# EAGLE schematic arcaduinome (EAGLE 7.1.0)
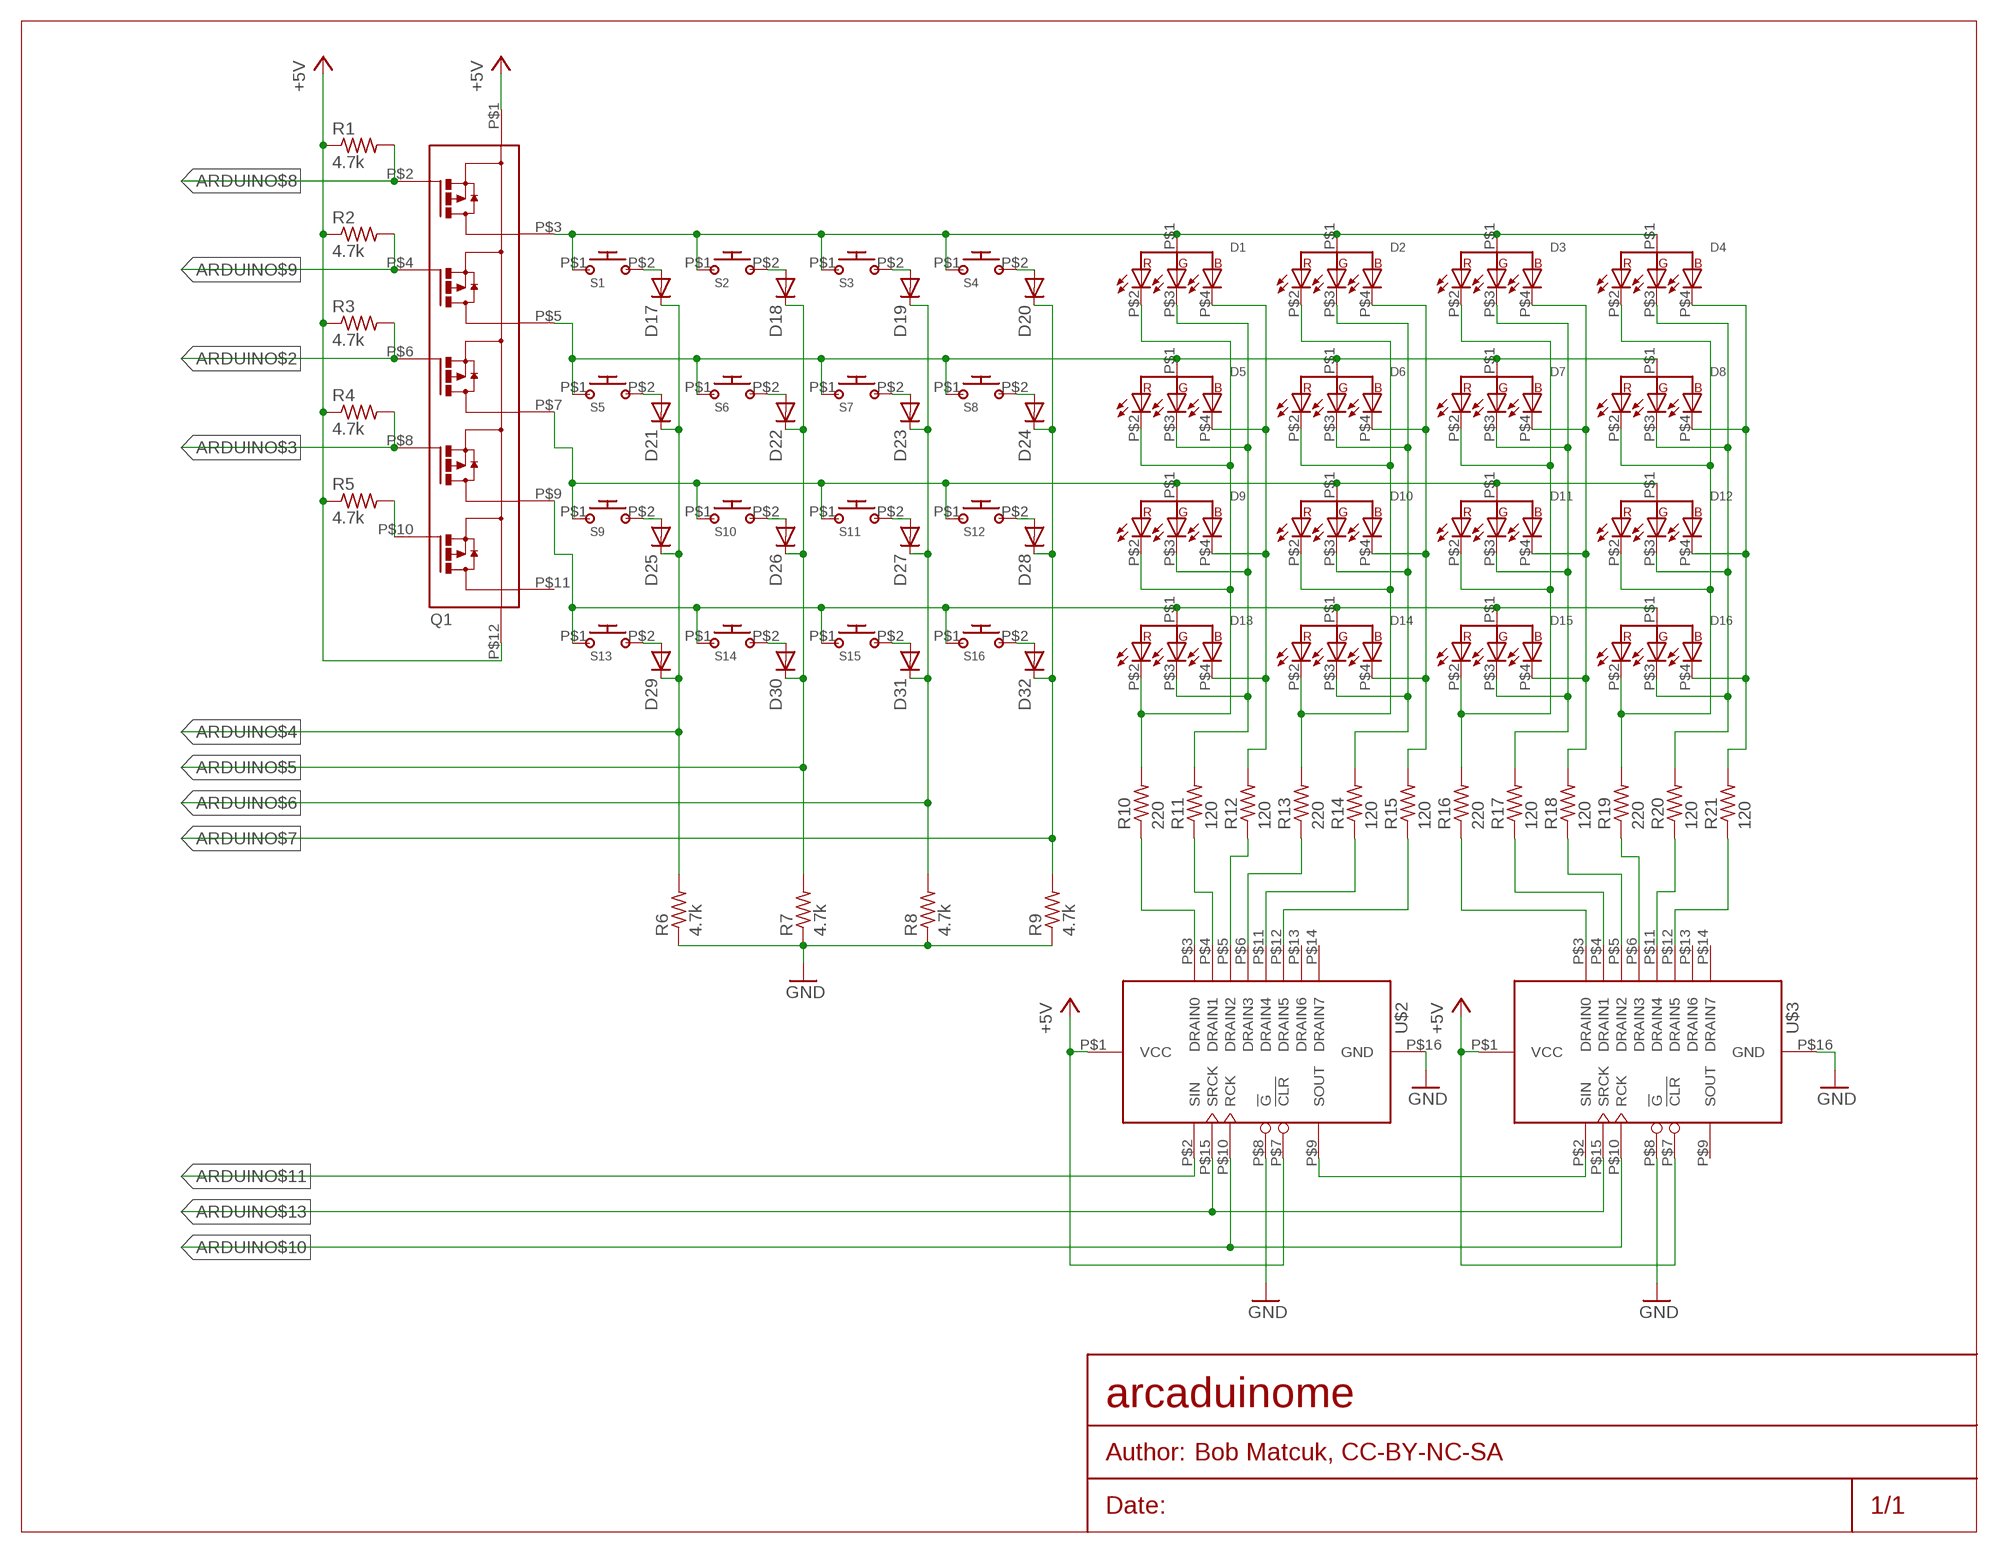
[diagram p0: schematic, sheet 1]

## Parts
D1  FD-5WSRGB-A  [5MM_RGB_LED]
D2  FD-5WSRGB-A  [5MM_RGB_LED]
D3  FD-5WSRGB-A  [5MM_RGB_LED]
D4  FD-5WSRGB-A  [5MM_RGB_LED]
D5  FD-5WSRGB-A  [5MM_RGB_LED]
D6  FD-5WSRGB-A  [5MM_RGB_LED]
D7  FD-5WSRGB-A  [5MM_RGB_LED]
D8  FD-5WSRGB-A  [5MM_RGB_LED]
D9  FD-5WSRGB-A  [5MM_RGB_LED]
D10  FD-5WSRGB-A  [5MM_RGB_LED]
D11  FD-5WSRGB-A  [5MM_RGB_LED]
D12  FD-5WSRGB-A  [5MM_RGB_LED]
D13  FD-5WSRGB-A  [5MM_RGB_LED]
D14  FD-5WSRGB-A  [5MM_RGB_LED]
D15  FD-5WSRGB-A  [5MM_RGB_LED]
D16  FD-5WSRGB-A  [5MM_RGB_LED]
D17  1N4148DO35-7  [DO35-7]
D18  1N4148DO35-7  [DO35-7]
D19  1N4148DO35-7  [DO35-7]
D20  1N4148DO35-7  [DO35-7]
D21  1N4148DO35-7  [DO35-7]
D22  1N4148DO35-7  [DO35-7]
D23  1N4148DO35-7  [DO35-7]
D24  1N4148DO35-7  [DO35-7]
D25  1N4148DO35-7  [DO35-7]
D26  1N4148DO35-7  [DO35-7]
D27  1N4148DO35-7  [DO35-7]
D28  1N4148DO35-7  [DO35-7]
D29  1N4148DO35-7  [DO35-7]
D30  1N4148DO35-7  [DO35-7]
D31  1N4148DO35-7  [DO35-7]
D32  1N4148DO35-7  [DO35-7]
Q1  SLA5086  [SLA12]
R1  4.7k  R-US_0207/10  [0207/10]
R2  4.7k  R-US_0207/10  [0207/10]
R3  4.7k  R-US_0207/10  [0207/10]
R4  4.7k  R-US_0207/10  [0207/10]
R5  4.7k  R-US_0207/10  [0207/10]
R6  4.7k  R-US_0207/10  [0207/10]
R7  4.7k  R-US_0207/10  [0207/10]
R8  4.7k  R-US_0207/10  [0207/10]
R9  4.7k  R-US_0207/10  [0207/10]
R10  220  R-US_0207/7  [0207/7]
R11  120  R-US_0204/5  [0204/5]
R12  120  R-US_0204/5  [0204/5]
R13  220  R-US_0207/7  [0207/7]
R14  120  R-US_0204/5  [0204/5]
R15  120  R-US_0204/5  [0204/5]
R16  220  R-US_0207/7  [0207/7]
R17  120  R-US_0204/5  [0204/5]
R18  120  R-US_0204/5  [0204/5]
R19  220  R-US_0207/7  [0207/7]
R20  120  R-US_0204/5  [0204/5]
R21  120  R-US_0204/5  [0204/5]
S1  SANWA_OBSC_24_CW  [SANWA_24MM]
S2  SANWA_OBSC_24_CW  [SANWA_24MM]
S3  SANWA_OBSC_24_CW  [SANWA_24MM]
S4  SANWA_OBSC_24_CW  [SANWA_24MM]
S5  SANWA_OBSC_24_CW  [SANWA_24MM]
S6  SANWA_OBSC_24_CW  [SANWA_24MM]
S7  SANWA_OBSC_24_CW  [SANWA_24MM]
S8  SANWA_OBSC_24_CW  [SANWA_24MM]
S9  SANWA_OBSC_24_CW  [SANWA_24MM]
S10  SANWA_OBSC_24_CW  [SANWA_24MM]
S11  SANWA_OBSC_24_CW  [SANWA_24MM]
S12  SANWA_OBSC_24_CW  [SANWA_24MM]
S13  SANWA_OBSC_24_CW  [SANWA_24MM]
S14  SANWA_OBSC_24_CW  [SANWA_24MM]
S15  SANWA_OBSC_24_CW  [SANWA_24MM]
S16  SANWA_OBSC_24_CW  [SANWA_24MM]
U$2  STPIC6D595  [DIP16]
U$3  STPIC6D595  [DIP16]

## Nets
+5V: Q1.P$1(S) Q1.P$12(S) R1.1 R2.1 R3.1 R4.1 R5.1 U$2.P$1(VCC) U$2.P$7(!CLR) U$3.P$1(VCC) U$3.P$7(!CLR)
ARDUINO$2: Q1.P$6(G$3) R3.2
ARDUINO$3: Q1.P$8(G$4) R4.2
ARDUINO$4: D17.C D21.C D25.C D29.C R6.2
ARDUINO$5: D18.C D22.C D26.C D30.C R7.2
ARDUINO$6: D19.C D23.C D27.C D31.C R8.2
ARDUINO$7: D20.C D24.C D28.C D32.C R9.2
ARDUINO$8: Q1.P$2(G$1) R1.2
ARDUINO$9: Q1.P$4(G$2) R2.2
ARDUINO$10: U$2.P$10(RCK) U$3.P$10(RCK)
ARDUINO$11: U$2.P$2(SIN)
ARDUINO$13: U$2.P$15(SRCK) U$3.P$15(SRCK)
GND: R6.1 R7.1 R8.1 R9.1 U$2.P$8(!G) U$2.P$16(GND) U$3.P$8(!G) U$3.P$16(GND)
N$1: D1.P$1(ANODE) D2.P$1(ANODE) D3.P$1(ANODE) D4.P$1(ANODE) Q1.P$3(D$1) S1.P$1 S2.P$1 S3.P$1 S4.P$1
N$2: D17.A S1.P$2
N$3: D18.A S2.P$2
N$4: D19.A S3.P$2
N$5: Q1.P$10(G$5) R5.2
N$6: D20.A S4.P$2
N$7: D5.P$1(ANODE) D6.P$1(ANODE) D7.P$1(ANODE) D8.P$1(ANODE) Q1.P$5(D$2) S5.P$1 S6.P$1 S7.P$1 S8.P$1
N$8: D21.A S5.P$2
N$9: D22.A S6.P$2
N$10: D23.A S7.P$2
N$11: D24.A S8.P$2
N$16: D9.P$1(ANODE) D10.P$1(ANODE) D11.P$1(ANODE) D12.P$1(ANODE) Q1.P$7(D$3) S9.P$1 S10.P$1 S11.P$1 S12.P$1
N$17: D25.A S9.P$2
N$18: D26.A S10.P$2
N$19: D27.A S11.P$2
N$20: D28.A S12.P$2
N$21: D13.P$1(ANODE) D14.P$1(ANODE) D15.P$1(ANODE) D16.P$1(ANODE) Q1.P$9(D$4) S13.P$1 S14.P$1 S15.P$1 S16.P$1
N$22: D29.A S13.P$2
N$23: D30.A S14.P$2
N$24: D31.A S15.P$2
N$25: D32.A S16.P$2
N$26: D1.P$2(R) D5.P$2(R) D9.P$2(R) D13.P$2(R) R10.2
N$27: D1.P$3(G) D5.P$3(G) D9.P$3(G) D13.P$3(G) R11.2
N$28: D1.P$4(B) D5.P$4(B) D9.P$4(B) D13.P$4(B) R12.2
N$29: D2.P$2(R) D6.P$2(R) D10.P$2(R) D14.P$2(R) R13.2
N$30: D2.P$3(G) D6.P$3(G) D10.P$3(G) D14.P$3(G) R14.2
N$31: D2.P$4(B) D6.P$4(B) D10.P$4(B) D14.P$4(B) R15.2
N$32: D3.P$2(R) D7.P$2(R) D11.P$2(R) D15.P$2(R) R16.2
N$33: D3.P$3(G) D7.P$3(G) D11.P$3(G) D15.P$3(G) R17.2
N$34: D3.P$4(B) D7.P$4(B) D11.P$4(B) D15.P$4(B) R18.2
N$35: D4.P$2(R) D8.P$2(R) D12.P$2(R) D16.P$2(R) R19.2
N$36: D4.P$3(G) D8.P$3(G) D12.P$3(G) D16.P$3(G) R20.2
N$37: D4.P$4(B) D8.P$4(B) D12.P$4(B) D16.P$4(B) R21.2
N$38: R10.1 U$2.P$3(DRAIN0)
N$39: R11.1 U$2.P$4(DRAIN1)
N$40: R15.1 U$2.P$12(DRAIN5)
N$41: R14.1 U$2.P$11(DRAIN4)
N$42: R13.1 U$2.P$6(DRAIN3)
N$43: R12.1 U$2.P$5(DRAIN2)
N$44: R21.1 U$3.P$12(DRAIN5)
N$45: R20.1 U$3.P$11(DRAIN4)
N$46: R16.1 U$3.P$3(DRAIN0)
N$47: R17.1 U$3.P$4(DRAIN1)
N$48: R18.1 U$3.P$5(DRAIN2)
N$49: R19.1 U$3.P$6(DRAIN3)
N$54: U$2.P$9(SOUT) U$3.P$2(SIN)
Unconnected: Q1.P$11(D$5) U$2.P$13(DRAIN6) U$2.P$14(DRAIN7) U$3.P$9(SOUT) U$3.P$13(DRAIN6) U$3.P$14(DRAIN7)

## Notes on the sheet
- Bob Matcuk, CC-BY-NC-SA

## Library data of the parts
D1-D16 = arcaduinome:FD-5WSRGB-A: FD-5WSRGB-A Common Anode RGB LED
D17-D32 = diode:1N4148: DIODE high speed (Philips)
Q1 = arcaduinome:SLA5086: SLA5086 The Sanken SLA5086 has five P-Channel Enhancement MOSFETs. The Source of all five transistors are connected together.
R1-R21 = resistor:R-US_: RESISTOR, American symbol
S1-S16 = arcaduinome:SANWA_OBSC_24_CW: Sanwa OBSC 24mm CW A 24mm arcade-style push button with clear casings and a white plunger.
U$2 U$3 = arcaduinome:STPIC6D595: STPIC6D595 The STMicroelectronics STPIC6D595 is a 74*595-style 8-bit Shift Register with output latches and open-drain DMOS transistor outputs designed for moderate load power (such as LEDs).